# Altium schematic sheet electrode 1.SchDoc
size 254 x 152 mm
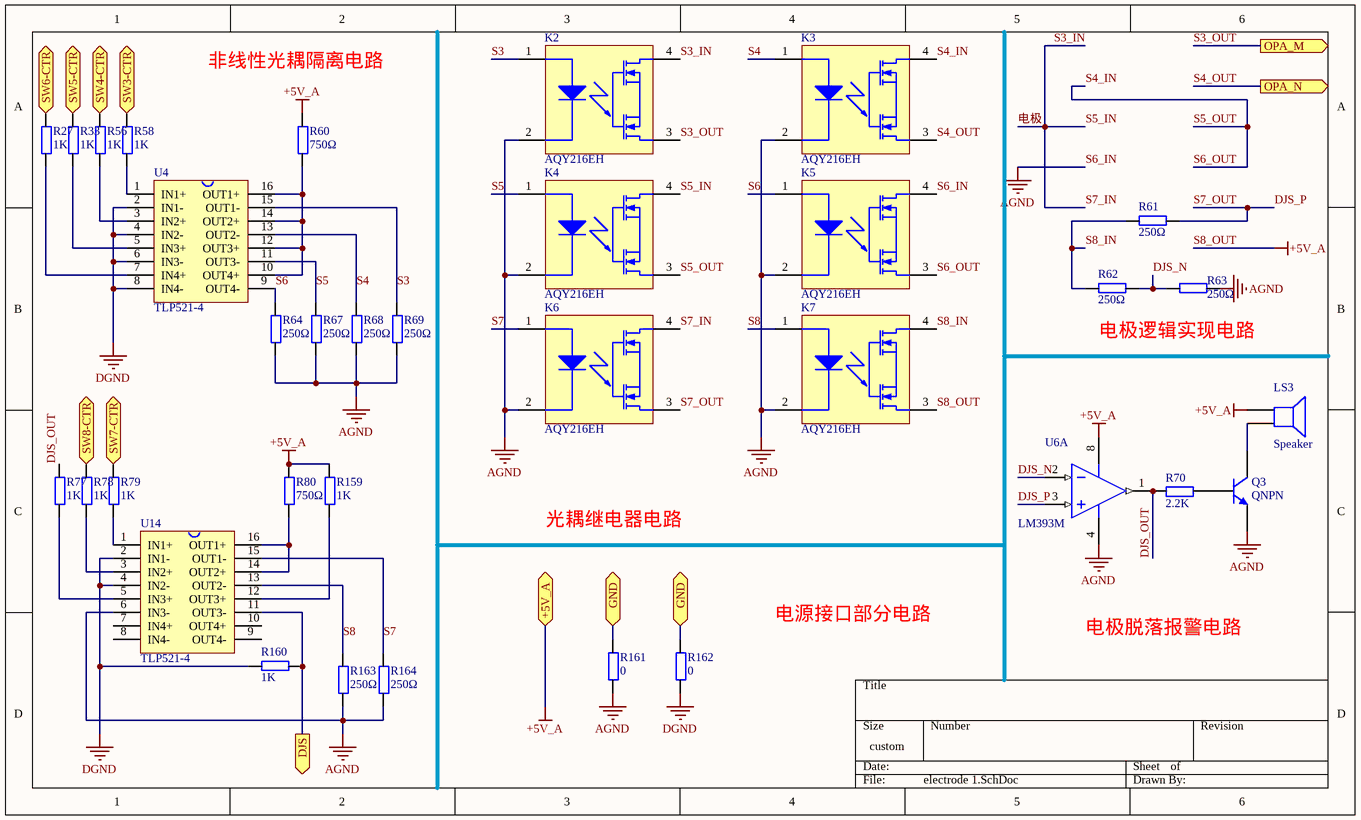
[diagram p0: electrode 1.SchDoc]

## Parts
K2  AQY216EH  [PNSC-DIP4_V]
K3  AQY216EH  [PNSC-DIP4_V]
K4  AQY216EH  [PNSC-DIP4_V]
K5  AQY216EH  [PNSC-DIP4_V]
K6  AQY216EH  [PNSC-DIP4_V]
K7  AQY216EH  [PNSC-DIP4_V]
LS3  Speaker  [PIN2]
Q3  QNPN  [SOT-23B_N]
R27  1K  [0603P]
R33  1K  [0603P]
R56  1K  [0603P]
R58  1K  [0603P]
R60  750Ω  [0603P]
R61  250Ω  [0603P]
R62  250Ω  [0603P]
R63  250Ω  [0603P]
R64  250Ω  [0603P]
R67  250Ω  [0603P]
R68  250Ω  [0603P]
R69  250Ω  [0603P]
R70  2.2K  [0603P]
R77  1K  [0603P]
R78  1K  [0603P]
R79  1K  [0603P]
R80  750Ω  [0603P]
R159  1K  [0603P]
R160  1K  [0603P]
R161  0  [0603P]
R162  0  [0603P]
R163  250Ω  [0603P]
R164  250Ω  [0603P]
U4  TLP521-4  [11-20A3]
U6  LM393M  [M08A_L]  (part A of 2)
U14  TLP521-4  [11-20A3]

## Ports
+5V_A, DJS (out), GND, OPA_M (out), OPA_N (out), SW3-CTR (in), SW4-CTR (in), SW5-CTR (in), SW6-CTR (in), SW7-CTR (in), SW8-CTR (in)

## Nets
DGND: R160.2 R162.1 U4.2(IN1-) U4.4(IN2-) U4.6(IN3-) U4.8(IN4-) U14.2(IN1-) U14.4(IN2-)
S6_IN: K2.2 K3.2 K4.2 K5.2 K5.4 K6.2 K7.2 Q3.3(E) R63.1 R64.1 R67.1 R68.1 R69.1 R161.1 R163.1 R164.1 U6.4(GND) U14.6(IN3-)  [also labelled AGND]
S8_OUT: K7.3 LS3.1 R60.2 R80.2 R159.2 U6.8(V+) ; port +5V_A  [also labelled +5V_A]
DJS: R160.1 U14.11(OUT3-) ; port DJS
DJS_N: R62.1 R63.2 U6.2(INA-)
DJS_OUT: R70.1 R77.2 U6.1(OUTA)
DJS_P: K6.3 R61.1 U6.3(INA+)  [also labelled S7_OUT]
GND: R161.2 R162.2 ; port GND
S3: K2.1 R69.2 U4.15(OUT1-)
S3_IN: K2.4 K4.4 K6.4  [also labelled S5_IN, S7_IN, 电极]
S3_OUT: K2.3 ; port OPA_M
S4: K3.1 R68.2 U4.13(OUT2-)
S4_IN: K3.4 K4.3 K5.3  [also labelled S5_OUT, S6_OUT]
S4_OUT: K3.3 ; port OPA_N
S5: K4.1 R67.2 U4.11(OUT3-)
S6: K5.1 R64.2 U4.9(OUT4-)
S7: K6.1 R164.2 U14.15(OUT1-)
S8: K7.1 R163.2 U14.13(OUT2-)
S8_IN: K7.4 R61.2 R62.2
SW3-CTR: R58.2 ; port SW3-CTR
SW4-CTR: R56.2 ; port SW4-CTR
SW5-CTR: R33.2 ; port SW5-CTR
SW6-CTR: R27.2 ; port SW6-CTR
SW7-CTR: R79.2 ; port SW7-CTR
SW8-CTR: R78.2 ; port SW8-CTR
NetLS3_2: LS3.2 Q3.1(C)
NetQ3_2: Q3.2(B) R70.2
NetR27_1: R27.1 U4.7(IN4+)
NetR33_1: R33.1 U4.5(IN3+)
NetR56_1: R56.1 U4.3(IN2+)
NetR58_1: R58.1 U4.1(IN1+)
NetR60_1: R60.1 U4.10(OUT4+) U4.12(OUT3+) U4.14(OUT2+) U4.16(OUT1+)
NetR77_1: R77.1 U14.5(IN3+)
NetR78_1: R78.1 U14.3(IN2+)
NetR79_1: R79.1 U14.1(IN1+)
NetR80_1: R80.1 U14.14(OUT2+) U14.16(OUT1+)
NetR159_1: R159.1 U14.12(OUT3+)

Not connected (* = marked no-connect by the designer): U14 7(IN4+) 8(IN4-) 9(OUT4-) 10(OUT4+)

## Notes on the sheet
- 非线性光耦隔离电路
- 电极逻辑实现电路
- 光耦继电器电路
- 电源接口部分电路
- 电极脱落报警电路

## Library data of the parts
K2-K7 = AQY216EH: PhotoMOS GE 1 Form A, 600 V Load Voltage, 0.05 A Continuous Load Current, -40 to 85 degC, 4-Pin DIP, Tube, RoHS; Manufacturer: Panasonic; Continuous Load Current: 0.05 A; Load Voltage: 600 V; On Resistance (Typ): 52 Ohm; Pb-Free: True; DatasheetVersion: 201404-T; PackageVersion: ASCTB67E, 04/2014; PackageReference: DIP4; PackageDescription: 4-Pin Through Hole Terminal Package, Body 4.78 x 6.4 mm, Pitch 2.54 mm; Supplier 1: Mouser; Supplier Part Number 1: 769-AQY216EH; Supplier 2: Digi-Key; Supplier Part Number 2: AQY216EH-ND; Packing: Tube; RoHS: True; Series: PhotoMOS GE 1 Form A; Mounting Technology: Through Hole; PartNumber: AQY216EH; ComponentLink1Description: Manufacturer URL; ComponentLink1URL: http://www3.panasonic.biz/ac/ae/index.jsp; ComponentLink2Description: Datasheet; ComponentLink2URL: http://www3.panasonic.biz/ac/e_download/control/relay/photomos/catalog/semi_eng_ge1a_aqy21_e.pdf; ComponentLink3Description: Package Specification; ComponentLink3URL: http://www3.panasonic.biz/ac/e_download/control/relay/photomos/catalog/semi_eng_dimensions.pdf?f_cd=401560
LS3 = Speaker: Loudspeaker; Published: 24-Mar-1999; LatestRevisionDate: 17-Jul-2002; LatestRevisionNote: Re-released for DXP Platform.; PackageReference: PIN2; Publisher: Altium Limited
Q3 = QNPN: NPN Bipolar Transistor; Published: 8-Jun-2000; LatestRevisionDate: 29-May-2009; LatestRevisionNote: IPC-7351 Footprint Added.; PackageVersion: Aug-1999; PackageReference: SOT-23B; Publisher: Altium Limited; PackageDescription: 3-Pin SOT-23 Package 0.95 mm Pitch, 2.4 mm Lead Span
R27 R33 R56 R58 R60-R64 R67-R70 R77-R80 R159-R164 = R
U4 U14 = TLP521
U6 = LM393M: Low Power Low Offset Voltage Dual Comparator, 8-pin Narrow SOIC; Manufacturer: National Semiconductor; PackageTopMarking: NSZXTT*LM*393M; PowerWise: N; CompType: Amplifiers; High-Reliability: Y; DatasheetVersion: Aug-2002; PackageVersion: revM, May-2009; PackageReference: M08A; PackageDescription: SOIC Narrow, 4.9 x 3.9 x 1.45mm, 8 Lead, 1.27mm Pitch; PartNumber: LM393M; RoHS: N; PinCount: 8; Code_JEDEC: MS-012-AA; Code_IPC: SOIC127P600-8; ComponentLink1Description: Manufacturer URL; ComponentLink1URL: http://www.national.com/; ComponentLink2Description: LM393 Datasheet; ComponentLink2URL: http://www.national.com/ds/LM/LM393.pdf; ComponentLink3Description: LM393 Web Page; ComponentLink3URL: http://www.national.com/pf/LM/LM393.html; ComponentLink4Description: M08A Package Page; ComponentLink4URL: http://www.national.com/packaging/folders/m08a.html